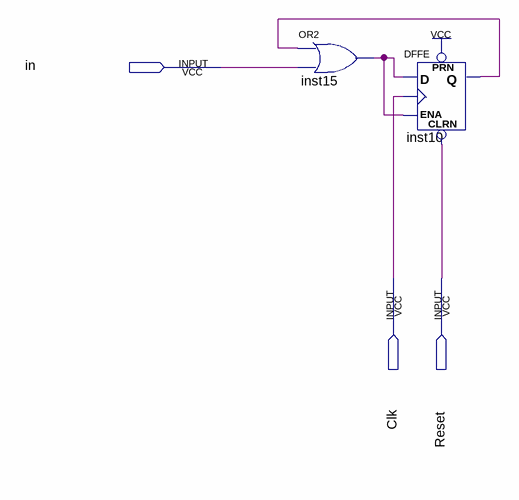
[diagram p0: schematic sheet]
// Quartus schematic FlipFlopMemory.bdf as structural Verilog: 2 symbols, 3 pins
module FlipFlopMemory (
  input  in,
  input  Clk,
  input  Reset
);

  wire inst10_q, inst15_out;

  or inst15 (inst15_out, inst10_q, in);
  DFFE inst10 (.PRN(1'b1), .CLRN(Reset), .D(inst15_out), .CLK(Clk), .ENA(inst15_out), .Q(inst10_q));
endmodule
